# EAGLE schematic 6R (EAGLE 9.5.0)
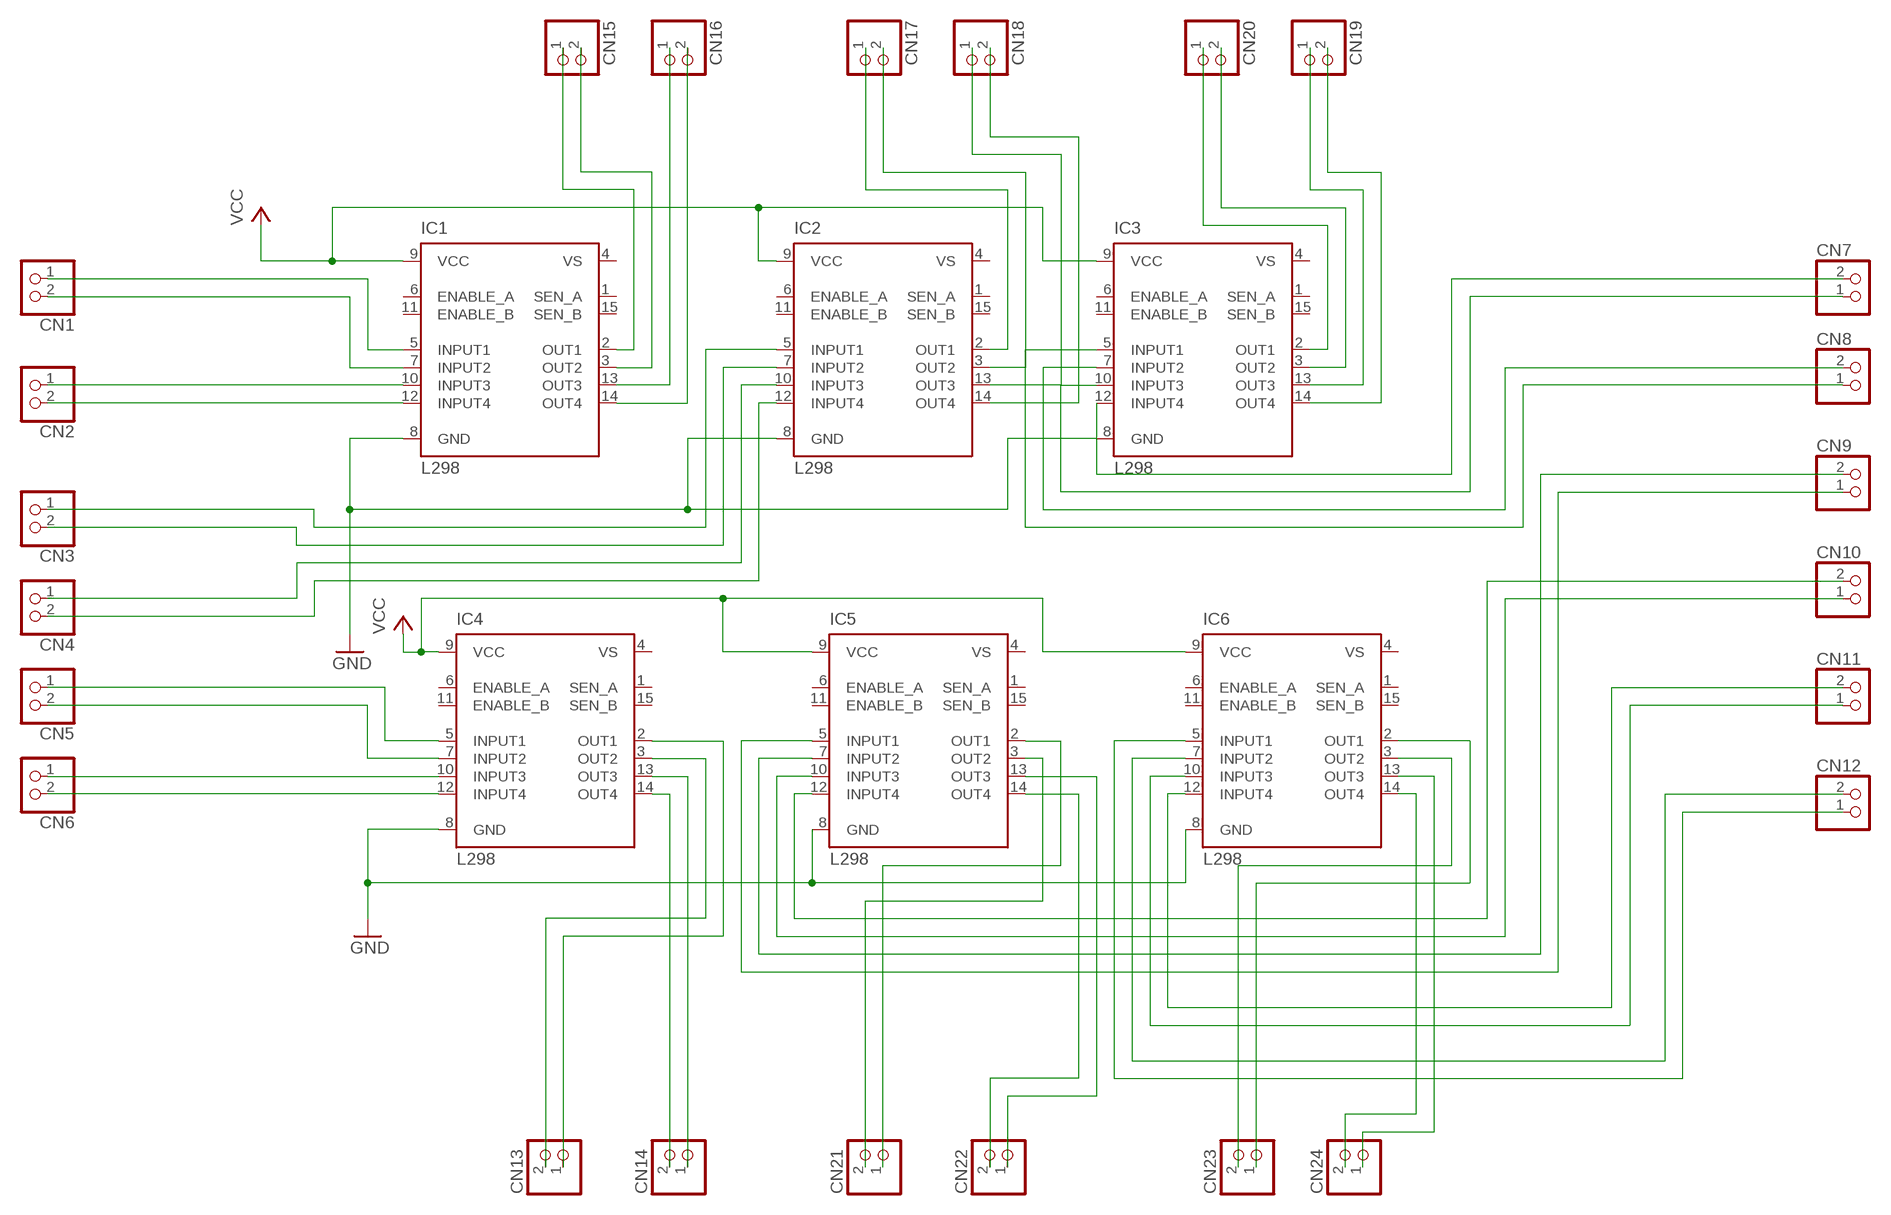
[diagram p0: schematic, sheet 1]

## Parts
CN1  JST_2PIN-SMT  [JST-PH-2-SMT]
CN2  JST_2PIN-SMT  [JST-PH-2-SMT]
CN3  JST_2PIN-SMT  [JST-PH-2-SMT]
CN4  JST_2PIN-SMT  [JST-PH-2-SMT]
CN5  JST_2PIN-SMT  [JST-PH-2-SMT]
CN6  JST_2PIN-SMT  [JST-PH-2-SMT]
CN7  JST_2PIN-SMT  [JST-PH-2-SMT]
CN8  JST_2PIN-SMT  [JST-PH-2-SMT]
CN9  JST_2PIN-SMT  [JST-PH-2-SMT]
CN10  JST_2PIN-SMT  [JST-PH-2-SMT]
CN11  JST_2PIN-SMT  [JST-PH-2-SMT]
CN12  JST_2PIN-SMT  [JST-PH-2-SMT]
CN13  JST_2PIN-SMT  [JST-PH-2-SMT]
CN14  JST_2PIN-SMT  [JST-PH-2-SMT]
CN15  JST_2PIN-SMT  [JST-PH-2-SMT]
CN16  JST_2PIN-SMT  [JST-PH-2-SMT]
CN17  JST_2PIN-SMT  [JST-PH-2-SMT]
CN18  JST_2PIN-SMT  [JST-PH-2-SMT]
CN19  JST_2PIN-SMT  [JST-PH-2-SMT]
CN20  JST_2PIN-SMT  [JST-PH-2-SMT]
CN21  JST_2PIN-SMT  [JST-PH-2-SMT]
CN22  JST_2PIN-SMT  [JST-PH-2-SMT]
CN23  JST_2PIN-SMT  [JST-PH-2-SMT]
CN24  JST_2PIN-SMT  [JST-PH-2-SMT]
IC1  L298  [MULTIWATT-15]
IC2  L298  [MULTIWATT-15]
IC3  L298  [MULTIWATT-15]
IC4  L298  [MULTIWATT-15]
IC5  L298  [MULTIWATT-15]
IC6  L298  [MULTIWATT-15]

## Nets
GND: IC1.8(GND) IC2.8(GND) IC3.8(GND) IC4.8(GND) IC5.8(GND) IC6.8(GND)
N$1: CN1.1 IC1.5(INPUT1)
N$2: CN1.2 IC1.7(INPUT2)
N$3: CN2.1 IC1.10(INPUT3)
N$4: CN2.2 IC1.12(INPUT4)
N$5: CN3.1 IC2.5(INPUT1)
N$6: CN3.2 IC2.7(INPUT2)
N$7: CN4.1 IC2.10(INPUT3)
N$8: CN4.2 IC2.12(INPUT4)
N$9: CN5.1 IC4.5(INPUT1)
N$10: CN5.2 IC4.7(INPUT2)
N$11: CN6.1 IC4.10(INPUT3)
N$12: CN6.2 IC4.12(INPUT4)
N$13: CN7.1 CN18.1 IC2.13(OUT3) IC3.10(INPUT3)
N$14: CN7.2 IC3.12(INPUT4)
N$15: CN8.2 IC3.7(INPUT2)
N$16: CN8.1 IC3.5(INPUT1)
N$17: CN9.1 IC5.5(INPUT1)
N$18: CN9.2 IC5.7(INPUT2)
N$19: CN10.1 IC5.10(INPUT3)
N$20: CN10.2 IC5.12(INPUT4)
N$21: CN15.1 IC1.2(OUT1)
N$22: CN15.2 IC1.3(OUT2)
N$23: CN16.1 IC1.13(OUT3)
N$24: CN16.2 IC1.14(OUT4)
N$25: CN17.1 IC2.2(OUT1)
N$26: CN11.1 IC6.10(INPUT3)
N$27: CN11.2 IC6.12(INPUT4)
N$28: CN12.1 IC6.5(INPUT1)
N$29: CN12.2 IC6.7(INPUT2)
N$30: CN18.2 IC2.14(OUT4)
N$31: CN17.2 IC2.3(OUT2)
N$32: CN20.1 IC3.2(OUT1)
N$33: CN20.2 IC3.3(OUT2)
N$34: CN19.1 IC3.13(OUT3)
N$35: CN19.2 IC3.14(OUT4)
N$36: CN13.1 IC4.2(OUT1)
N$37: CN13.2 IC4.3(OUT2)
N$38: CN14.1 IC4.13(OUT3)
N$39: CN14.2 IC4.14(OUT4)
N$40: CN21.1 IC5.2(OUT1)
N$41: CN22.1 IC5.13(OUT3)
N$42: CN21.2 IC5.3(OUT2)
N$43: CN22.2 IC5.14(OUT4)
N$44: CN23.1
N$45: IC6.2(OUT1)
N$46: CN23.2 IC6.3(OUT2)
N$47: CN24.1 IC6.13(OUT3)
N$48: CN24.2 IC6.14(OUT4)
VCC: IC1.9(VCC) IC2.9(VCC) IC3.9(VCC) IC4.9(VCC) IC5.9(VCC) IC6.9(VCC)
Unconnected: IC1.1(SEN_A) IC1.6(ENABLE_A) IC1.11(ENABLE_B) IC1.15(SEN_B) IC2.1(SEN_A) IC2.6(ENABLE_A) IC2.11(ENABLE_B) IC2.15(SEN_B) IC3.1(SEN_A) IC3.6(ENABLE_A) IC3.11(ENABLE_B) IC3.15(SEN_B) IC4.1(SEN_A) IC4.6(ENABLE_A) IC4.11(ENABLE_B) IC4.15(SEN_B) IC5.1(SEN_A) IC5.6(ENABLE_A) IC5.11(ENABLE_B) IC5.15(SEN_B) IC6.1(SEN_A) IC6.6(ENABLE_A) IC6.11(ENABLE_B) IC6.15(SEN_B)

## Power pins joined to a net without a drawn wire
VS: IC1.4(VS) IC2.4(VS) IC3.4(VS) IC4.4(VS) IC5.4(VS) IC6.4(VS)

## Library data of the parts
CN1-CN24 = adafruit:JST_2PIN: JST 2-Pin Connectors of various flavors SMT-RA (S2B-PH-SM4) 4UConnector #17311 SMT (B2B-PH-SM4) THM-RA (S2B-PH) THM (B2B-PH)
IC1-IC6 = st-microelectronics:L298: DUAL FULL-BRIDGE DRIVER; MPN: L298N; OC_FARNELL: 1589425; OC_NEWARK: 32M1527